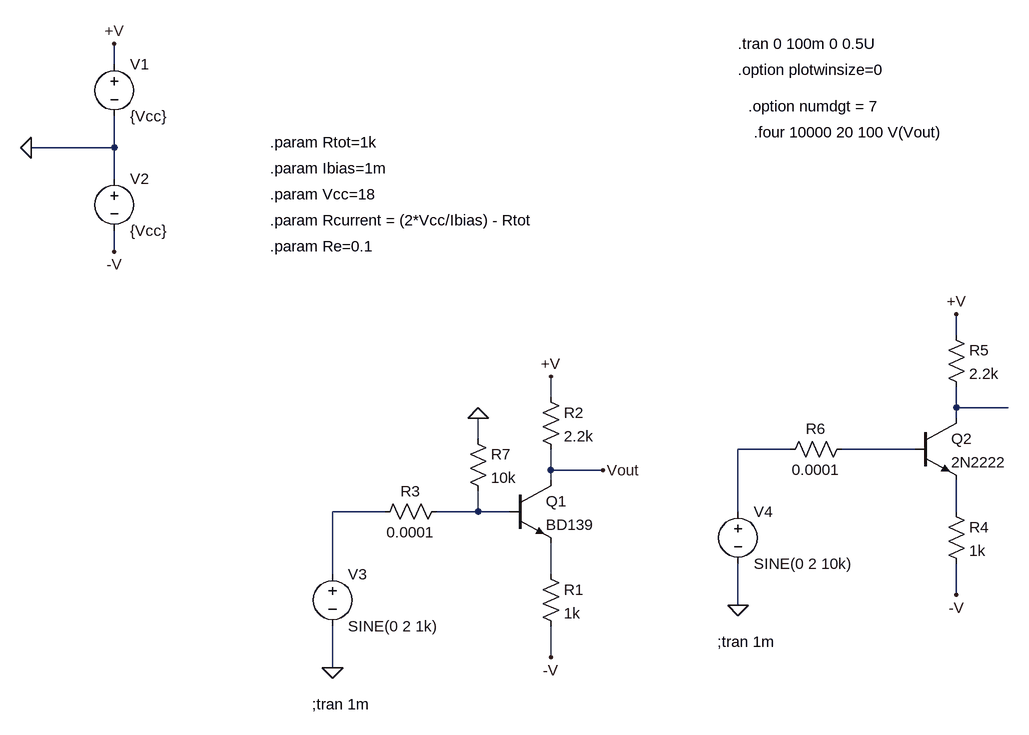
[diagram p0: schematic Draft1.asc]
Draft1.asc, the LTspice schematic file:
Version 4
SHEET 1 920 680
WIRE -528 -624 -528 -656
WIRE -528 -496 -528 -544
WIRE -528 -496 -656 -496
WIRE -528 -448 -528 -496
WIRE -528 -336 -528 -368
WIRE 768 -208 768 -240
WIRE 144 -112 144 -144
WIRE 768 -96 768 -128
WIRE 848 -96 768 -96
WIRE 768 -80 768 -96
WIRE 32 -48 32 -80
WIRE 512 -32 432 -32
WIRE 704 -32 592 -32
WIRE 144 0 144 -32
WIRE 224 0 144 0
WIRE 144 16 144 0
WIRE -112 64 -192 64
WIRE 32 64 32 32
WIRE 32 64 -32 64
WIRE 80 64 32 64
WIRE 432 64 432 -32
WIRE 768 64 768 16
WIRE -192 160 -192 64
WIRE 144 160 144 112
WIRE 768 192 768 144
WIRE 432 208 432 144
WIRE 144 288 144 240
WIRE -192 304 -192 240
FLAG -656 -496 0
FLAG -528 -656 +V
FLAG -528 -336 -V
FLAG 144 288 -V
FLAG 144 -144 +V
FLAG -192 304 0
FLAG 224 0 Vout
FLAG 768 192 -V
FLAG 768 -240 +V
FLAG 432 208 0
FLAG 32 -80 0
SYMBOL npn 80 16 R0
SYMATTR InstName Q1
SYMATTR Value BD139
SYMBOL res 128 144 R0
SYMATTR InstName R1
SYMATTR Value 1k
SYMBOL res 128 -128 R0
SYMATTR InstName R2
SYMATTR Value 2.2k
SYMBOL voltage -528 -640 R0
WINDOW 123 0 0 Left 0
WINDOW 39 0 0 Left 0
SYMATTR InstName V1
SYMATTR Value {Vcc}
SYMBOL voltage -528 -464 R0
WINDOW 123 0 0 Left 0
WINDOW 39 0 0 Left 0
SYMATTR InstName V2
SYMATTR Value {Vcc}
SYMBOL voltage -192 144 R0
WINDOW 123 0 0 Left 0
WINDOW 39 0 0 Left 0
SYMATTR InstName V3
SYMATTR Value SINE(0 2 1k)
SYMBOL res -16 48 R90
WINDOW 0 0 56 VBottom 2
WINDOW 3 32 56 VTop 2
SYMATTR InstName R3
SYMATTR Value 0.0001
SYMBOL npn 704 -80 R0
SYMATTR InstName Q2
SYMATTR Value 2N2222
SYMBOL res 752 48 R0
SYMATTR InstName R4
SYMATTR Value 1k
SYMBOL res 752 -224 R0
SYMATTR InstName R5
SYMATTR Value 2.2k
SYMBOL voltage 432 48 R0
WINDOW 123 0 0 Left 0
WINDOW 39 0 0 Left 0
SYMATTR InstName V4
SYMATTR Value SINE(0 2 10k)
SYMBOL res 608 -48 R90
WINDOW 0 0 56 VBottom 2
WINDOW 3 32 56 VTop 2
SYMATTR InstName R6
SYMATTR Value 0.0001
SYMBOL res 16 -64 R0
SYMATTR InstName R7
SYMATTR Value 10k
TEXT -288 -504 Left 2 !.param Rtot=1k
TEXT -288 -464 Left 2 !.param Ibias=1m
TEXT -288 -424 Left 2 !.param Vcc=18
TEXT -288 -384 Left 2 !.param Rcurrent = (2*Vcc/Ibias) - Rtot
TEXT -288 -344 Left 2 !.param Re=0.1
TEXT 432 -656 Left 2 !.tran 0 100m 0 0.5U
TEXT 432 -616 Left 2 !.option plotwinsize=0
TEXT 448 -560 Left 2 !.option numdgt = 7
TEXT 456 -520 Left 2 !.four 10000 20 100 V(Vout)
TEXT -224 360 Left 2 !;tran 1m
TEXT 400 264 Left 2 !;tran 1m

The netlist it stands for:
* Draft1.asc
Q1 Vout N005 N007 0 BD139
R1 N007 -V 1k
R2 +V Vout 2.2k
V1 +V 0 {Vcc}
V2 0 -V {Vcc}
V3 N004 0 SINE(0 2 1k)
R3 N005 N004 0.0001
Q2 N001 N003 N006 0 2N2222
R4 N006 -V 1k
R5 +V N001 2.2k
V4 N002 0 SINE(0 2 10k)
R6 N003 N002 0.0001
R7 0 N005 10k
.model NPN NPN
.model PNP PNP
.lib standard.bjt
.param Rtot=1k
.param Ibias=1m
.param Vcc=18
.param Rcurrent = (2*Vcc/Ibias) - Rtot
.param Re=0.1
.tran 0 100m 0 0.5U
.option plotwinsize=0
.option numdgt = 7
.four 10000 20 100 V(Vout)
;tran 1m
;tran 1m
.backanno
.end